# Altium schematic sheet UKU207xx_power_board.SchDoc
size A3
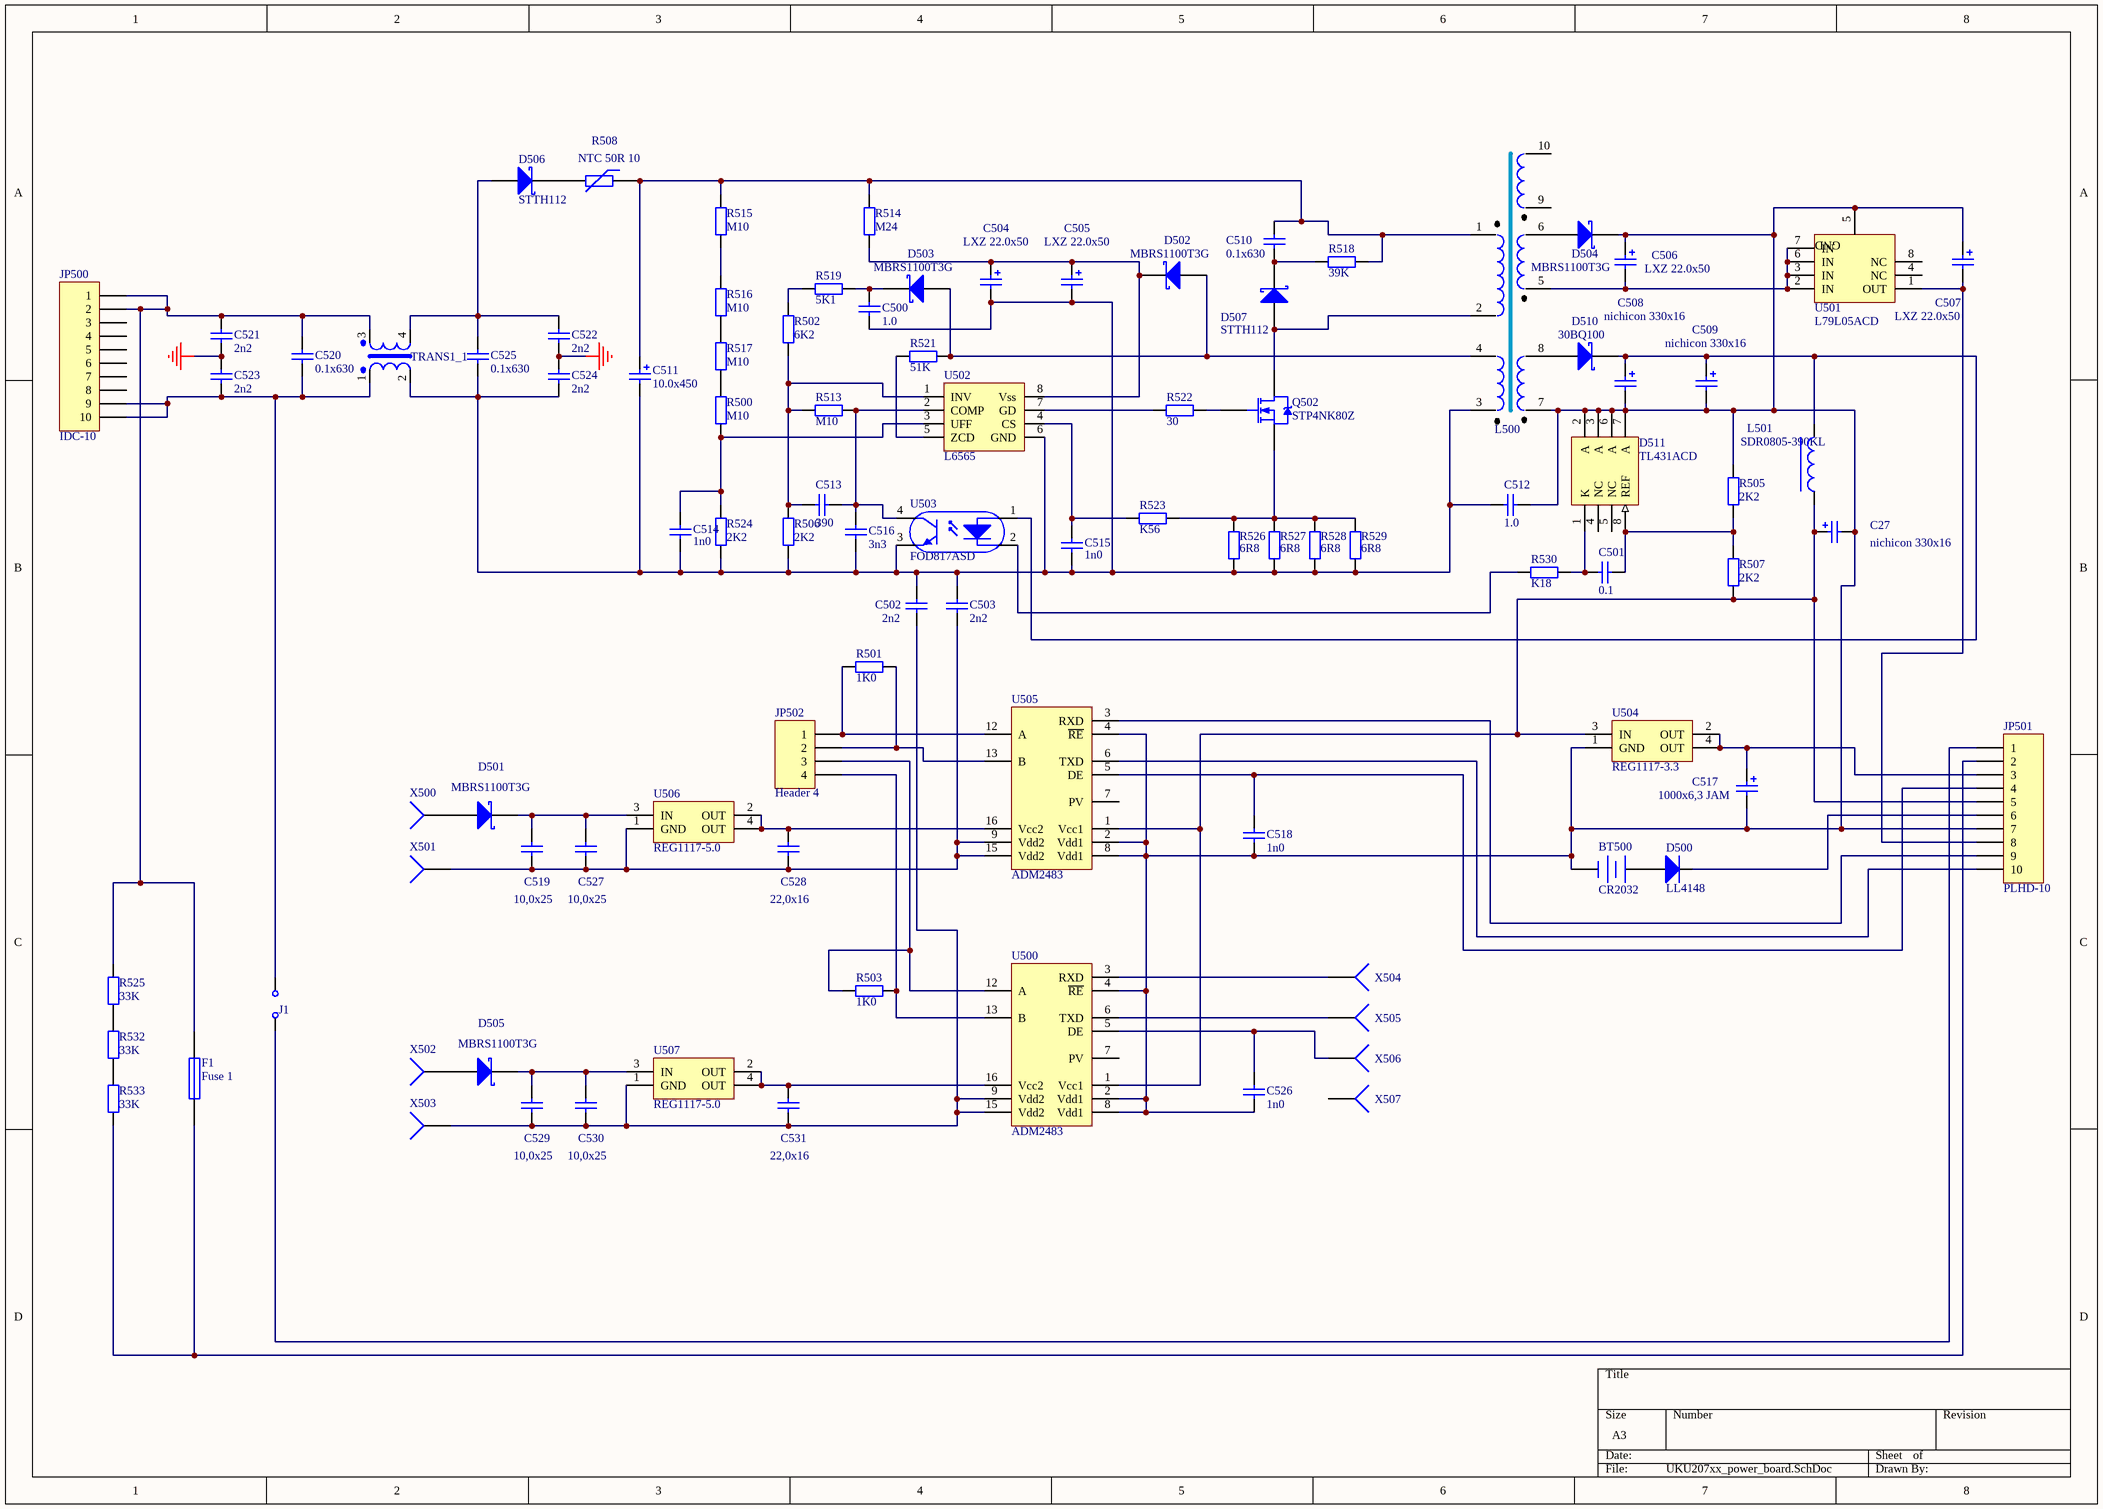
[diagram p0: UKU207xx_power_board.SchDoc]

## Parts
BT500  CR2032  [BAT_HOLD_SMD1]
C27  nichicon 330x16  [el3]
C500  1.0  [_1206]
C501  0.1  [_1206]
C502  2n2  [C8]
C503  2n2  [C8]
C504  LXZ 22.0x50  [el3]
C505  LXZ 22.0x50  [el3]
C506  LXZ 22.0x50  [el3]
C507  LXZ 22.0x50  [el3]
C508  nichicon 330x16  [el3]
C509  nichicon 330x16  [el3]
C510  0.1x630  [c15]
C511  10.0x450  [el_15_25_h]
C512  1.0  [C8]
C513  390  [_1206]
C514  1n0  [_1206]
C515  1n0  [_1206]
C516  3n3  [_1206]
C517  1000x6,3 JAM  [el5]
C518  1n0  [_1206]
C519  value 10,0x25  [_1206]  (hidden comment: 1.0)
C520  0.1x630  [c15]
C521  2n2  [C8]
C522  2n2  [c8]
C523  2n2  [c8]
C524  2n2  [c8]
C525  0.1х630  [c15]
C526  1n0  [_1206]
C527  value 10,0x25  [_1206]  (hidden comment: 1.0)
C528  value 22,0x16  [_1206]  (hidden comment: 1.0)
C529  value 10,0x25  [_1206]  (hidden comment: 1.0)
C530  value 10,0x25  [_1206]  (hidden comment: 1.0)
C531  value 22,0x16  [_1206]  (hidden comment: 1.0)
D500  LL4148  [_1206d]
D501  MBRS1100T3G  [D_6_3]
D502  MBRS1100T3G  [D_6_3]
D503  MBRS1100T3G  [D_6_3]
D504  MBRS1100T3G  [D_6_3]
D505  MBRS1100T3G  [D_6_3]
D506  STTH112  [D_6_3]
D507  STTH112  [D_6_3]
D510  30BQ100  [30BQ100]
D511  TL431ACD  [SO-G8]
F1  Fuse 1  [PIN-W2/E2.8]
J1  (no value)  [BT5-2]
JP500  IDC-10  [HDR2X5]
JP501  PLHD-10  [HDR2X5]
JP502  Header 4  [2EDG-5.08-4]
L500  L220-K10  [trans_ring1]  (value not drawn)
L501  SDR0805-390KL  [L10x10]
Q502  STP4NK80Z  [TO220_h]
R500  M10  [_1206]
R501  1K0  [_1206]
R502  6K2  [_1206]
R503  1K0  [_1206]
R505  2K2  [_1206]
R506  2K2  [_1206]
R507  2K2  [_1206]
R508  NTC 50R 10  [JVR07N]
R513  M10  [_1206]
R514  M24  [AXIAL-0.7]
R515  M10  [_1206]
R516  M10  [_1206]
R517  M10  [_1206]
R518  39K  [AXIAL-0.7]
R519  5K1  [_1206]
R521  51K  [_1206]
R522  30  [_1206]
R523  K56  [_1206]
R524  2K2  [_1206]
R525  33K  [_1206]
R526  6R8  [_1206]
R527  6R8  [_1206]
R528  6R8  [_1206]
R529  6R8  [_1206]
R530  K18  [_1206]
R532  33K  [_1206]
R533  33K  [_1206]
T500  TRANS1_1  [3030R4]
U500  ADM2483  [SO-G16/D10.4]
U501  L79L05ACD  [SO-G8]
U502  L6565  [so-g8]
U503  FOD817ASD  [FOD817ASD]
U504  REG1117-3.3  [DSO-G3]
U505  ADM2483  [SO-G16/D10.4]
U506  REG1117-5.0  [DSO-G3]
U507  REG1117-5.0  [DSO-G3]
X500  Socket  [PIN1]  (value not drawn)
X501  Socket  [PIN1]  (value not drawn)
X502  Socket  [PIN1]  (value not drawn)
X503  Socket  [PIN1]  (value not drawn)
X504  Socket  [PIN1]  (value not drawn)
X505  Socket  [PIN1]  (value not drawn)
X506  Socket  [PIN1]  (value not drawn)
X507  Socket  [PIN1]  (value not drawn)

## Nets
GND_GND: C521.1 C522.1 C523.2 C524.2
NetBT500_1: BT500.1(+) D500.1(A)
NetBT500_2: BT500.2(-) C27.2 C506.1 C507.1 C508.2 C509.2 C512.1 C517.2 C518.1 C526.1 D504.2(K) D511.2(A) D511.3(A) D511.6(A) D511.7(A) JP501.7 L500.7 R505.2 U500.2(Vdd1) U500.4(~{RE}) U500.8(Vdd1) U501.5(GND) U504.1(GND) U505.2(Vdd1) U505.4(~{RE}) U505.8(Vdd1)
NetC27_1: C27.1 JP501.5 L501.1 R507.1 U500.1(Vcc1) U504.3(IN) U505.1(Vcc1)
NetC500_1: C500.1 C502.2 C503.2 C504.2 C505.2 C511.2 C512.2 C514.2 C515.2 C516.1 C524.1 C525.1 L500.3 R506.1 R524.1 R526.2 R527.2 R528.2 R529.2 T500.2(Pri-) U502.6(GND) U503.3
NetC500_2: C500.2 D503.2(K) R519.1
NetC501_1: C501.1 D511.8(REF) R505.1 R507.2
NetC501_2: C501.2 D511.1(K) R530.1
NetC502_1: C502.1 C529.1 C530.1 C531.1 U500.9(Vdd2) U500.15(Vdd2) U507.1(GND) X503.1
NetC503_1: C503.1 C519.1 C527.1 C528.1 U505.9(Vdd2) U505.15(Vdd2) U506.1(GND) X501.1
NetC504_1: C504.1 C505.1 D502.2(K) R514.1 U502.8(Vss)
NetC506_2: C506.2 L500.5 U501.2(IN) U501.3(IN) U501.6(IN) U501.7(IN)
NetC507_2: C507.2 JP501.8 U501.1(OUT)
NetC508_1: C508.1 C509.1 D510.2(K) L501.2 U503.1
NetC510_1: C510.1 D507.2(K) R518.2
NetC510_2: C510.2 C511.1 L500.1 R508.1 R514.2 R515.2 R518.1
NetC513_1: C513.1 R502.1 R506.2 R513.2 U502.1(INV)
NetC513_2: C513.2 C516.2 R513.1 U502.2(COMP) U503.4
NetC514_1: C514.1 R500.1 R524.2 U502.3(UFF)
NetC515_1: C515.1 R523.2 U502.4(CS)
NetC517_1: C517.1 JP501.3 U504.2(OUT) U504.4(OUT)
NetC518_2: C518.2 JP501.4 U505.5(DE)
NetC519_2: C519.2 C527.2 D501.2(K) U506.3(IN)
NetC520_1: C520.1 C523.1 J1.1 JP500.9 JP500.10 T500.1(Pri+)
NetC520_2: C520.2 C521.2 F1.2 JP500.1 JP500.2 R525.2 T500.3(Sec1+)
NetC522_2: C522.2 C525.2 D506.1(A) T500.4(Sec1-)
NetC526_2: C526.2 U500.5(DE) X506.1
NetC528_2: C528.2 U505.16(Vcc2) U506.2(OUT) U506.4(OUT)
NetC529_2: C529.2 C530.2 D505.2(K) U507.3(IN)
NetC531_2: C531.2 U500.16(Vcc2) U507.2(OUT) U507.4(OUT)
NetD500_2: D500.2(K) JP501.6
NetD501_1: D501.1(A) X500.1
NetD502_1: D502.1(A) D503.1(A) L500.4 R521.1
NetD504_1: D504.1(A) L500.6
NetD505_1: D505.1(A) X502.1
NetD506_2: D506.2(K) R508.2
NetD507_1: D507.1(A) L500.2 Q502.2(D)
NetD510_1: D510.1(A) L500.8
NetF1_1: F1.1 JP501.2 R533.1
NetJ1_2: J1.2 JP501.1
NetJP501_9: JP501.9 U505.3(RXD)
NetJP501_10: JP501.10 U505.6(TXD)
NetJP502_1: JP502.1 R501.2 U505.12(A)
NetJP502_2: JP502.2 R501.1 U505.13(B)
NetJP502_3: JP502.3 R503.2 U500.12(A)
NetJP502_4: JP502.4 R503.1 U500.13(B)
NetQ502_1: Q502.1(G) R522.1
NetQ502_3: Q502.3(S) R523.1 R526.1 R527.1 R528.1 R529.1
NetR500_2: R500.2 R517.1
NetR502_2: R502.2 R519.2
NetR515_1: R515.1 R516.2
NetR516_1: R516.1 R517.2
NetR521_2: R521.2 U502.5(ZCD)
NetR522_2: R522.2 U502.7(GD)
NetR525_1: R525.1 R532.2
NetR530_2: R530.2 U503.2
NetR532_1: R532.1 R533.2
NetU500_3: U500.3(RXD) X504.1
NetU500_6: U500.6(TXD) X505.1

Not connected (* = marked no-connect by the designer): D511 4(NC) 5(NC); JP500 3 4 5 6 7 8; L500 9 10; U500 7(PV); U501 4(NC) 8(NC); U505 7(PV); X507 1

## Library data of the parts
BT500 = Battery: Multicell Battery; Manufacturer: Generic Components; Published: 24-Mar-1999; Revision: July-2002: Re-released for DXP Platform.; Publisher: Altium Limited
C27 C504-C509 C511 C517 = Cap Pol1: Polarized Capacitor (Radial); Manufacturer: Generic Components; Class I: Passive; Value: 22,0x50; Published: 8-Jun-2000; Revision: July-2002: Re-released for DXP Platform.; Publisher: Altium Limited; Class II: Capacitor
C500-C503 C510 C512-C516 C518 C520-C526 = Cap Semi: Capacitor (Semiconductor SIM Model); Manufacturer: Generic Components; Class I: Passive; Value: 1,0; Published: 8-Jun-2000; Revision: July-2002: Re-released for DXP Platform.; Publisher: Altium Limited; Class II: Capacitor
C519 C527-C531 = Cap Semi: Capacitor (Semiconductor SIM Model); Manufacturer: Generic Components; Class I: Passive; Published: 8-Jun-2000; Revision: July-2002: Re-released for DXP Platform.; Publisher: Altium Limited; Class II: Capacitor
D500 = Diode: Default Diode; Manufacturer: Generic Components; Class I: Discrete; Class II: Diode - Switching; Published: 8-Jun-2000; Revision: July-2002: Re-released for DXP Platform.; Publisher: Altium Limited
D501-D505 D510 = 10BQ015: Schottky Rectifier; Manufacturer: International Rectifier; Revision 1: 10-July-2000: SIM Model Added.; Revision 2: July-2002: Re-released for DXP Platform.; Class I: Discrete; Class II: Rectifier - Schottky; Published: 8-Jun-2000; Datasheet: Latest Revision: PD-2.396A; Package Reference: DO-214AA; Publisher: Altium Limited
D506 D507 = 10BQ015: Schottky Diode; Manufacturer: International Rectifier; Revision 1: 10-July-2000: SIM Model Added.; Revision 2: July-2002: Re-released for DXP Platform.; Class I: Discrete; Class II: Rectifier - Schottky; Value: 10BQ100; Published: 8-Jun-2000; Datasheet: Latest Revision: PD-2.396A; Package Reference: DO-214AA; Publisher: Altium Limited
D511 = TL431ACD: Programmable Precision Reference; Manufacturer: Motorola; Class I: Power Management; Class II: Voltage Reference; Published: 15-Apr-2002; Datasheet: Linear and Interface Integrated Circuits, DL128 Rev2 (1988); Package Reference: 751-02; Publisher: Altium Limited
F1 = Fuse 1: Fuse; Manufacturer: Generic Components; Class I: Passive; Published: 8-Jun-2000; Revision: July-2002: Re-released for DXP Platform.; Publisher: Altium Limited; Class II: Fuse
J1 = JMP: Switch; Manufacturer: Generic Components; Published: 24-Mar-1999; Revision: July-2002: Re-released for DXP Platform.; Publisher: Altium Limited
JP500 JP501 = Header 10: Header, 10-Pin; Manufacturer: Generic Components; Class I: Connector; Revision: July-2002: Re-released for DXP Platform.; Publisher: Altium Limited
JP502 = Header 4: Header, 4-Pin; Manufacturer: Generic Components; Class I: Connector; Revision: July-2002: Re-released for DXP Platform.; Publisher: Altium Limited
L500 = L1_dc_2: Дроссель
L501 = Inductor Konstr 2: Magnetic-Core Inductor; Manufacturer: Generic Components; Class I: Passive; Published: 24-Mar-1999; Revision: July-2002: Re-released for DXP Platform.; Publisher: Altium Limited; Class II: Inductor
Q502 = NMOS-2: N-Channel Power MOSFET; Manufacturer: Generic Components; Class I: Discrete; Class II: MOSFET - Power; Note: Pin 2 is electrically connected to pin 4.; Published: 8-Jun-2000; Revision: July-2002: Re-released for DXP Platform.; Datasheet: Latest Revision: PD-9.814; Package Reference: TO-220AB; Publisher: Altium Limited
R500 R502 R505-R507 R513-R519 R521-R530 R532 R533 = Res2: Resistor; Manufacturer: Generic Components; Class I: Passive; Value: 1K0; Rule: Undefined; Published: 8-Jun-2000; Revision: July-2002: Re-released for DXP Platform.; Publisher: Altium Limited; Class II: Resistor
R501 R503 = Res2: Resistor; Manufacturer: Generic Components; Class I: Passive; Rule: Undefined; Published: 8-Jun-2000; Revision: July-2002: Re-released for DXP Platform.; Publisher: Altium Limited; Class II: Resistor; Value: 1K0
R508 = Res Varistor: Varistor (Voltage-Sensitive Resistor); Manufacturer: Generic Components; Class I: Discrete; Published: 24-Mar-1999; Revision: July-2002: Re-released for DXP Platform.; Publisher: Altium Limited; Class II: Voltage-Sensitive Resistor
T500 = TRANS1_1: Manufacturer: Generic Components; Class I: Passive; Class II: Transformer; Published: 25-Jan-2001; Revision: July-2002: Re-released for DXP Platform.; Publisher: Altium Limited
U501 = L79L05ACD: Negative Voltage Regulator; Manufacturer: ST-Microelectronics; Package Information: Latest Revision: Jul-1998; Class I: Power Management; Published: 24-Aug-2001; Revision: July-2002: Re-released for DXP Platform.; Datasheet: Latest Revision: Apr-1999; Package Reference: SO8; Publisher: Altium Limited; Class II: Voltage Regulator
U503 = F00817ASD
U504 U506 U507 = REG1117-3.3: 800mA and 1A Low Dropout Positive Regulator 2.85V, 3.3V, 5V, and Adjustable; Manufacturer: Burr-Brown; Package Information: Latest Revision: Rev. C; Class I: Power Management; Class II: Voltage Regulator; Published: 8-Jun-2000; Revision: July-2002: Re-released for DXP Platform.; Datasheet: Latest Revision: Sep-1997; Package Reference: ZZ311; Publisher: Altium Limited
X500-X507 = Socket: Manufacturer: Generic Components; Class I: Connector; Revision: July-2002: Re-released for DXP Platform.; Publisher: Altium Limited